# EAGLE design nes2msx (EAGLE 8.3.1)
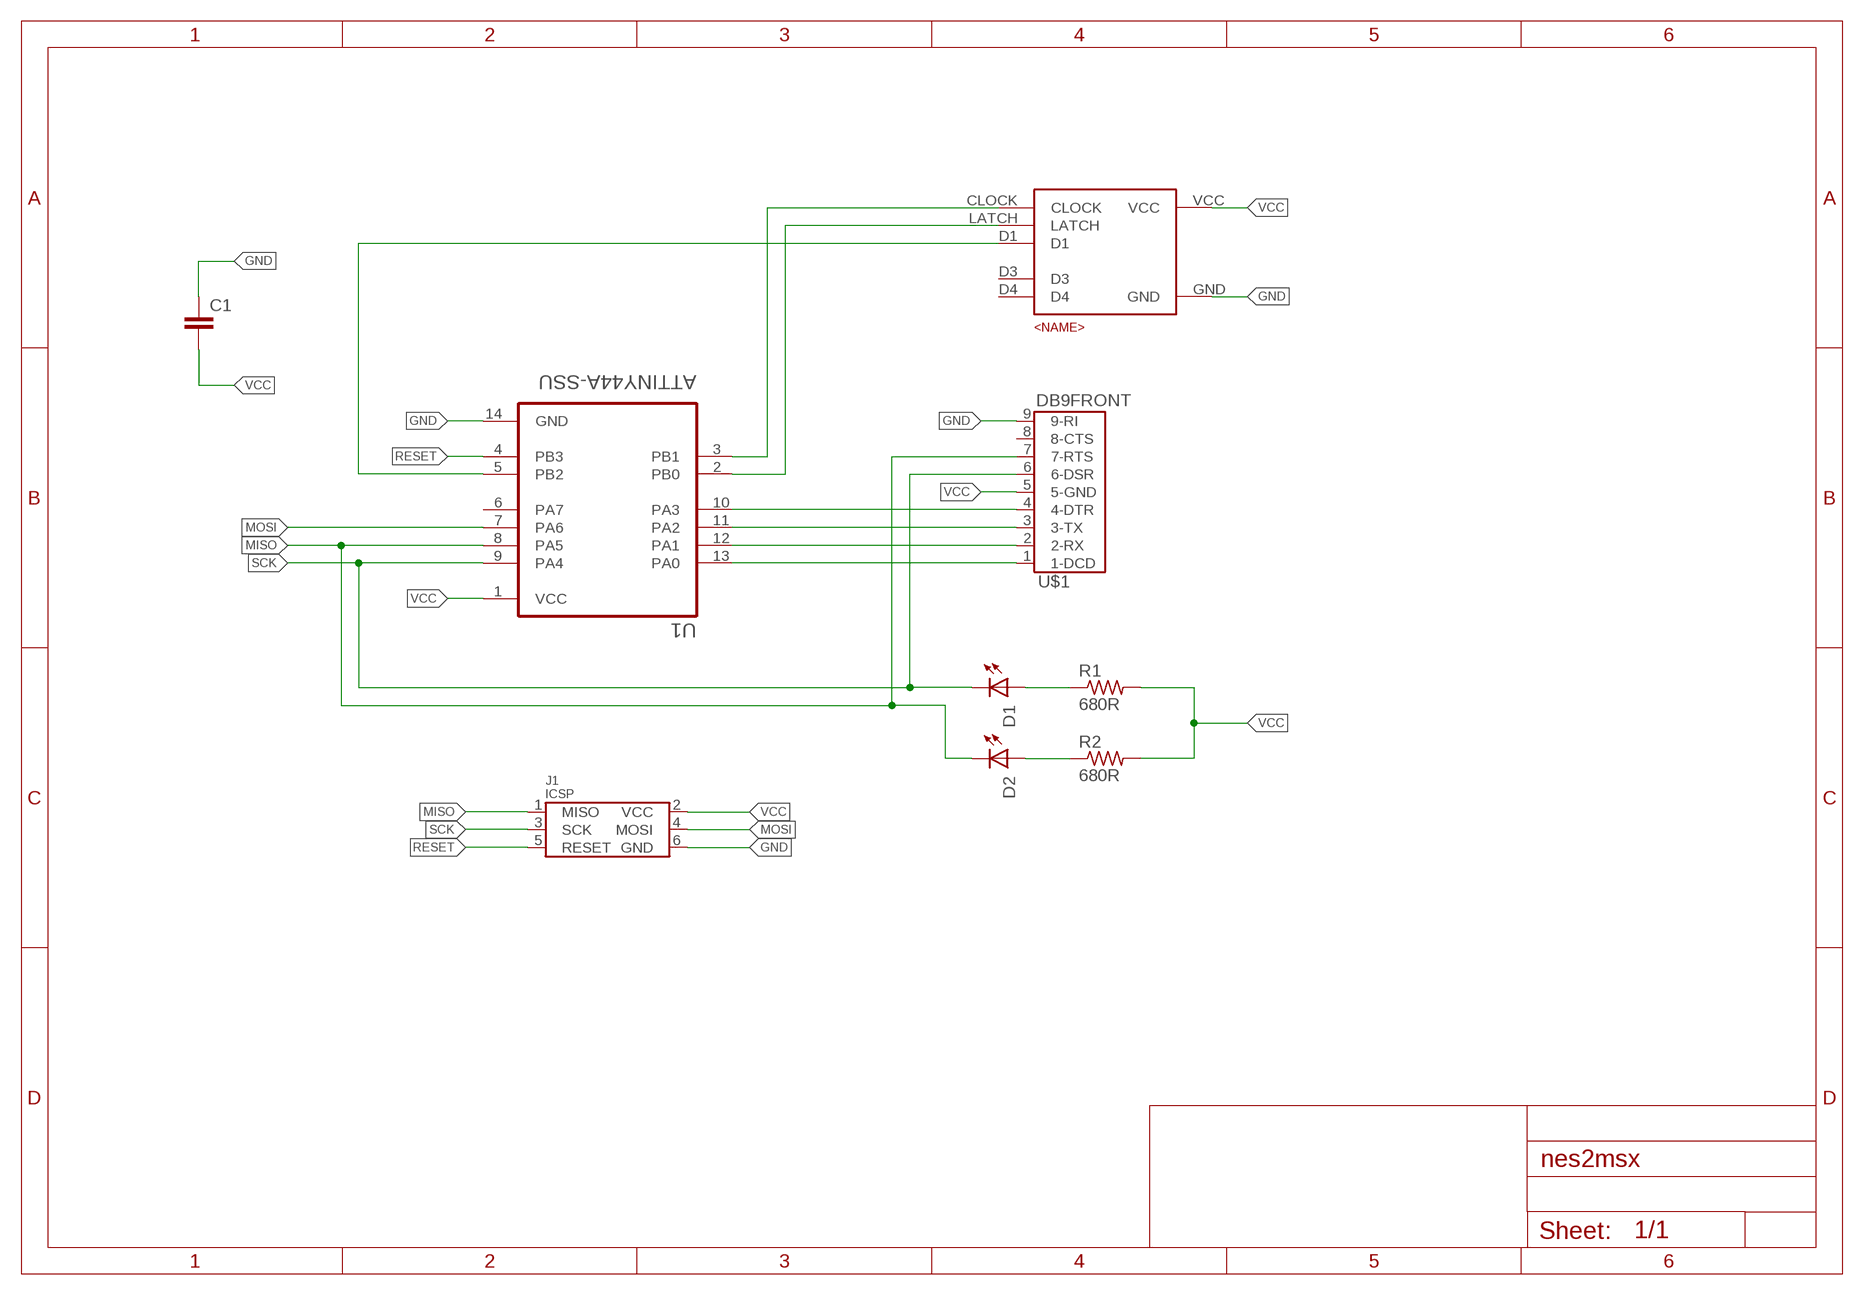
[diagram p0: schematic, sheet 1]

## Parts
C1  C-EUC0805  [C0805]
D1  LED-0805  [0805-LED]
D2  LED-0805  [0805-LED]
J1  ICSP  [M03X2]
R1  680R  R-US_R0805  [R0805]
R2  680R  R-US_R0805  [R0805]
U1  ATTINY44A-SSU  [SOIC127P600X175-14N]
U$1  DB9FRONT  [DB9_FRONT]
U$3  NES_CONTROLLERL  [NES_CONTROLLER]

## Nets
GND [PWR]: C1.1 J1.6(GND) U1.14(GND) U$1.9(9-RI) U$3.GND
MISO: D2.C J1.1(MISO) U1.8(PA5) U$1.7(7-RTS)
MOSI: J1.4(MOSI) U1.7(PA6)
N$1: U1.13(PA0) U$1.1(1-DCD)
N$2: U1.12(PA1) U$1.2(2-RX)
N$3: U1.11(PA2) U$1.3(3-TX)
N$4: U1.10(PA3) U$1.4(4-DTR)
N$5: U1.3(PB1) U$3.CLOCK
N$6: U1.2(PB0) U$3.LATCH
N$7: U1.5(PB2) U$3.D1
N$9: D1.A R1.1
N$10: D2.A R2.1
RESET: J1.5(RESET) U1.4(PB3)
SCK: D1.C J1.3(SCK) U1.9(PA4) U$1.6(6-DSR)
VCC [PWR]: C1.2 J1.2(VCC) R1.2 R2.2 U1.1(VCC) U$1.5(5-GND) U$3.VCC
Unconnected: U1.6(PA7) U$1.8(8-CTS) U$3.D3 U$3.D4

## Library data of the parts
C1 = resistor:C-EU: CAPACITOR, European symbol
D1 D2 = Passives:LED
J1 = work:ICSP
R1 R2 = resistor:R-US_: RESISTOR, American symbol
U1 = ATTINY44A-SSU:ATTINY44A-SSU: Check availability <https://pricing.snapeda.com/parts/ATTINY44A-SSU/Microchip/view-part?ref=eda>; AVAILABILITY: In Stock; CHECK_PRICES: https://www.snapeda.com/parts/ATTINY44A-SSU/Microchip+Technology/view-part/?ref=eda; DESCRIPTION: AVR AVR® ATtiny Microcontroller IC 8-Bit 20MHz 4KB (2K x 16) FLASH 14-SOIC; MF: Microchip; MP: ATTINY44A-SSU; PACKAGE: SOIC-14 Microchip; PRICE: None; SNAPEDA_LINK: https://www.snapeda.com/parts/ATTINY44A-SSU/Microchip+Technology/view-part/?ref=snap
U$1 = cristian:DB9
U$3 = cristian:NES_CONTROLLER

## Net classes
0 default: width 0.406 mm
1 PWR: width 0.406 mm

## Board
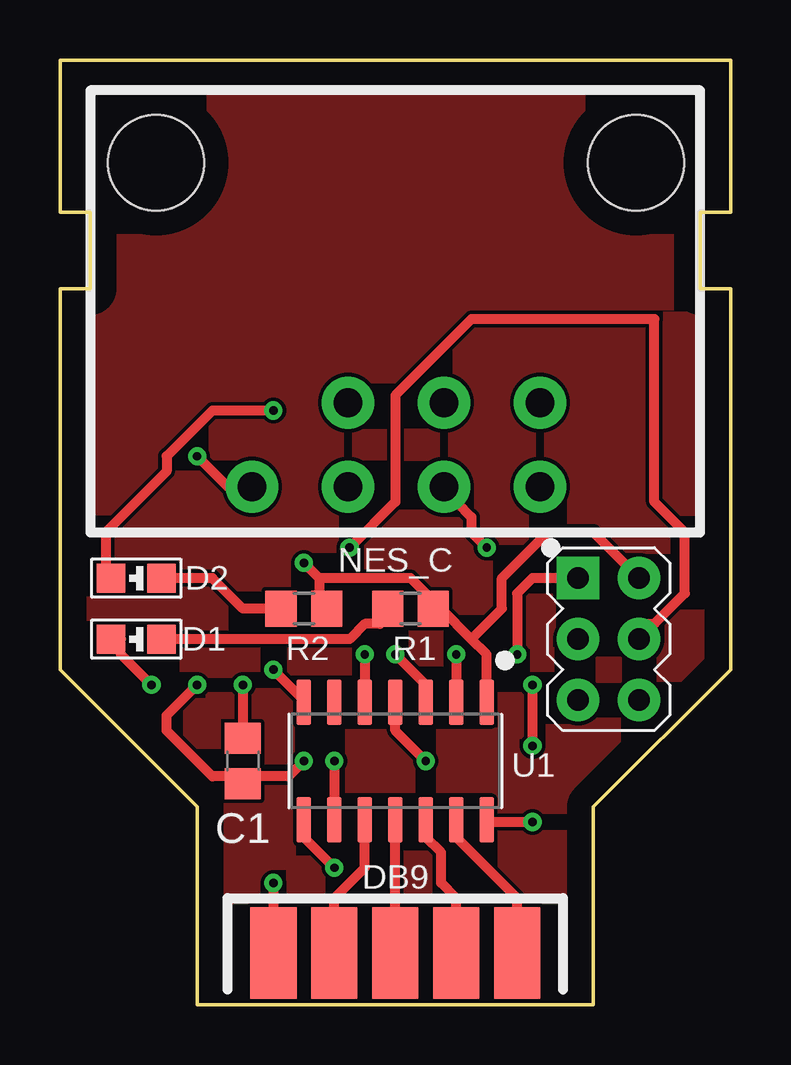
[diagram p1: board, top side]
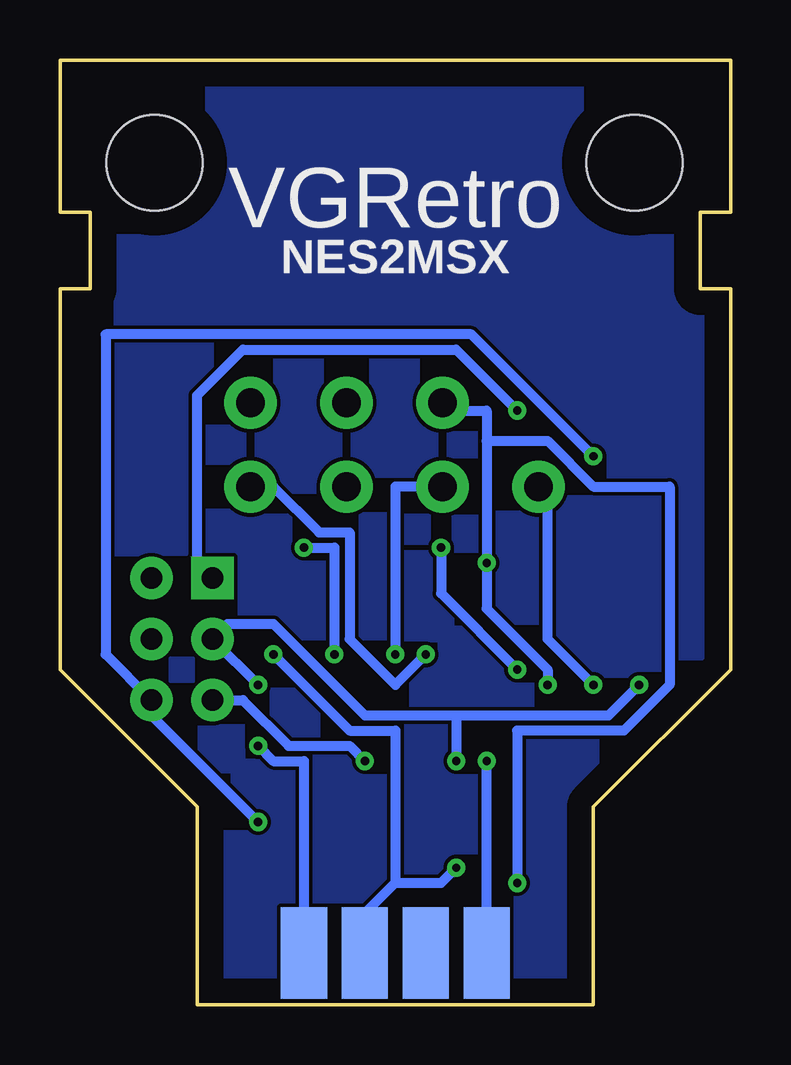
[diagram p2: board, bottom side, seen from below]

Size 27.94 x 39.37 mm. Coordinates in mm from the lower left corner, seen from the top.
Outline: 5.71,0 5.71,8.26 0,13.97 0,29.84 1.27,29.84 1.27,33.02 0,33.02 0,39.37 27.94,39.37 27.94,33.02 26.67,33.02 26.67,29.84 27.94,29.84 27.94,13.97 22.23,8.26 22.23,0 5.71,0
Copper layers (1*16): Top 0.035mm / dielectric 1.5mm / Bottom 0.035mm
Design rules "default *": minimum track width 6mil, minimum drill 0.35mm, track to track 6mil, track to pad 12mil, pad to pad 12mil, via to via 12mil, smd to smd 6mil, copper to edge 40mil, drill to drill 12mil, minimum pad ring 10mil, minimum via ring 8mil, stop-mask expansion 4mil, vias tented up to drill 0mil, thermal gap 10mil

### Footprints (pad centres in the part's own frame; a part is rotated, then mirrored left to right if it is on the bottom)
C0805 = smd 1.3 x 1.5: 1 -0.95,0; 2 0.95,0
0805-LED = smd 1.2 x 1.2: A -1.05,0; C 1.05,0
M03X2 = drill 0.9 pad 1.778 square: 1 -2.54,-1.27 | drill 0.9 pad 1.778: 2 -2.54,1.27; 3 0,-1.27; 4 0,1.27; 5 2.54,-1.27; 6 2.54,1.27
R0805 = smd 1.3 x 1.5: 1 -0.95,0; 2 0.95,0
SOIC127P600X175-14N = smd 1.9 x 0.6: 1 -2.455,3.81; 2 -2.455,2.54; 3 -2.455,1.27; 4 -2.455,0; 5 -2.455,-1.27; 6 -2.455,-2.54; 7 -2.455,-3.81; 8 2.455,-3.81; 9 2.455,-2.54; 10 2.455,-1.27; 11 2.455,0; 12 2.455,1.27; 13 2.455,2.54; 14 2.455,3.81
DB9_FRONT = smd 1.93 x 3.81: 1 0,2.54; 2 2.54,2.54; 3 5.08,2.54; 4 7.62,2.54; 5 10.16,2.54 | smd 1.93 x 3.81 bottom: 6 1.27,2.54; 7 3.81,2.54; 8 6.35,2.54; 9 8.89,2.54
NES_CONTROLLER = drill 1.2 pad 2.184: CLOCK 0,-4; D1 0,-12; D3 3.5,-8; D4 3.5,-12; GND 0,0; LATCH 0,-8; VCC 3.5,-4 | hole 4: 13.5,4; 13.5,-16

### Placement (x,y rotation side)
C1  7.62,10.16 90 top
D1  3.17,15.24 180 top
D2  3.17,17.78 180 top
J1  22.86,15.24 270 top
R1  14.61,16.51 0 top
R2  10.16,16.51 0 top
U1  13.97,10.16 270 top
U$1  19.05,4.7 180 top
U$3  8,21.59 90 top

### Tracks (layer width: path | path; a pad name or v marks a point on that pad's centre or on a via)
GND  (via drill 0.35)
  Top 0.406: v19.68,7.62 17.78,7.62 U1.14 | 7.62,9.53 9.53,9.53 v10.16,10.16 | v5.71,13.34 4.45,12.06 4.45,11.43 6.35,9.53 7.62,9.53 | 7.62,9.53 C1.1 | v5.71,22.86 6.99,21.59 U$3.GND
  Bottom 0.406: v19.68,7.62 24.13,12.06 J1.6 26.04,14.61 26.04,27.94 10.79,27.94 v5.71,22.86 | U$1.9 v10.16,10.16 | v5.71,13.34 7.62,15.24 7.62,21.59 U$3.GND
MISO  (via drill 0.35)
  Top 0.406: U1.8 10.16,6.99 v11.43,5.71 | v8.89,24.77 6.35,24.77 4.45,22.86 4.45,22.23 1.91,19.68 1.91,17.78 D2.C | v19.05,14.61 19.05,17.14 19.68,17.78 J1.1
  Bottom 0.406: v11.43,5.71 12.06,5.08 13.97,5.08 | 13.97,5.08 15.24,3.81 U$1.7 | v8.89,24.77 11.43,27.3 20.32,27.3 22.23,25.4 22.23,17.78 J1.1 | 13.97,5.08 13.97,11.43 15.88,11.43 v19.05,14.61
MOSI  (via drill 0.35)
  Top 0.406: v8.89,13.97 10.16,12.7 U1.7 | v12.06,19.05 13.97,20.95 13.97,25.4 17.14,28.57 24.77,28.57 24.77,20.95 26.04,19.68 26.04,17.14 24.77,15.88 24.13,15.88 J1.4
  Bottom 0.406: v8.89,13.97 12.06,17.14 v12.06,19.05
N$1
  Top 0.406: U1.13 16.51,6.99 19.05,4.45 U$1.1
N$2
  Top 0.406: U1.12 15.24,6.99 15.88,6.35 15.88,5.08 16.51,4.45 U$1.2
N$3
  Top 0.406: U$1.3 U1.11
N$4
  Top 0.406: U1.10 12.7,5.71 11.43,4.45 U$1.4
N$5  (via drill 0.35)
  Top 0.406: U1.3 15.24,13.34 v13.97,14.61
  Bottom 0.406: v13.97,14.61 13.97,21.59 U$3.CLOCK
N$6  (via drill 0.35)
  Top 0.406: v16.51,14.61 U1.2 | v17.78,19.05 17.14,19.68 17.14,20.32 16.51,20.95 16.51,21.59 U$3.LATCH
  Bottom 0.406: v16.51,14.61 16.51,19.05 v17.78,19.05
N$7  (via drill 0.35)
  Top 0.406: v12.7,14.61 U1.5
  Bottom 0.406: v12.7,14.61 13.97,13.34 15.88,15.24 15.88,19.68 17.14,19.68 19.05,21.59 U$3.D1
N$9
  Top 0.406: D1.A 12.06,15.24 12.7,15.88 13.34,15.88 13.34,16.51 R1.1
N$10
  Top 0.406: D2.A 6.35,17.78 7.62,16.51 R2.1
N$11
  pour Top: 0,39.37 0,33.02 1.27,33.02 1.27,29.84 0,29.84 0,13.97 5.71,8.26 5.71,0 22.23,0 22.23,8.26 27.94,13.97 27.94,29.84 26.67,29.84 26.67,33.02 27.94,33.02 27.94,39.37
N$12
  pour Bottom: 0,39.37 0,33.02 1.27,33.02 1.27,29.84 0,29.84 0,13.97 5.71,8.26 5.71,0 22.23,0 22.23,8.26 27.94,13.97 27.94,29.84 26.67,29.84 26.67,33.02 27.94,33.02 27.94,39.37
RESET  (via drill 0.35)
  Top 0.406: U1.4 13.97,11.43 v15.24,10.16
  Bottom 0.406: v15.24,10.16 15.88,10.79 18.41,10.79 20.32,12.7 J1.5
SCK  (via drill 0.35)
  Top 0.406: v3.81,13.34 2.54,14.61 2.54,15.24 D1.C | v11.43,10.16 U1.9 | v19.68,13.34 v19.68,10.79
  Bottom 0.406: v3.81,13.34 5.08,12.06 11.43,12.06 | 11.43,12.06 15.24,12.06 19.05,15.88 20.95,15.88 J1.3 v19.68,13.34 | 11.43,12.06 v11.43,10.16 | U$1.6 17.78,10.16 19.05,10.16 v19.68,10.79
VCC  (via drill 0.35)
  Top 0.406: 17.14,15.24 17.78,14.61 U1.1 | 17.14,15.24 15.88,16.51 R1.2 15.24,16.51 15.24,17.14 14.61,17.78 10.79,17.78 | J1.2 22.23,19.68 20.32,19.68 18.41,17.78 18.41,16.51 17.14,15.24 | v7.62,13.34 C1.2 | 10.79,17.78 10.79,16.51 R2.2 | v10.16,18.41 10.79,17.78 | v8.89,5.08 U$1.5
  Bottom 0.406: v7.62,13.34 7.62,13.97 10.16,16.51 v10.16,18.41 10.16,23.5 | 10.16,23.5 10.16,24.77 11.43,24.77 U$3.VCC | v8.89,5.08 8.89,11.43 4.45,11.43 2.54,13.34 2.54,21.59 5.71,21.59 7.62,23.5 10.16,23.5

### Text on the board
tNames: NES_C | DB9
bNames: VGRetro | NES2MSX